# Altium schematic sheet power.SchDoc
size B
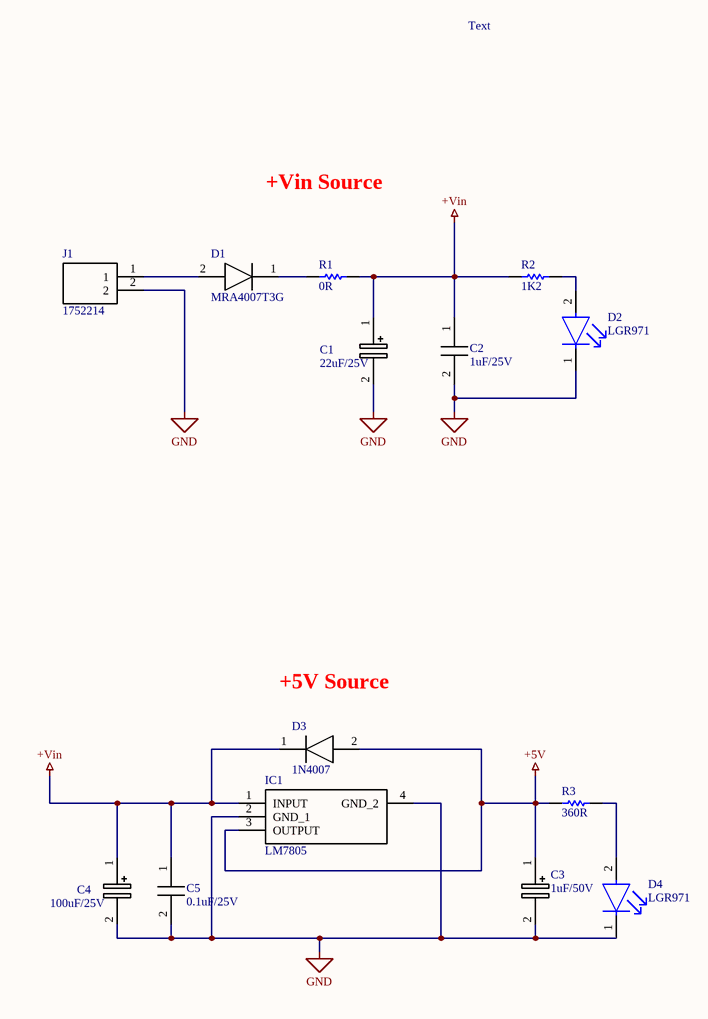
[diagram p0: power.SchDoc]

## Parts
C1  22uF/25V  [CAPAE530X610N]
C2  1uF/25V  [CAPC2012X70N]
C3  1uF/50V  [CAPAE430X550N]
C4  100uF/25V  [CAPAE660X770N]
C5  0.1uF/25V  [CAPC2012X70N]
D1  MRA4007T3G  [DIOM5226X220N]
D2  LGR971  [FP-LG_R971-MFG]
D3  1N4007  [DIOM5027X244N]
D4  LGR971  [FP-LG_R971-MFG]
IC1  LM7805  [SOT230P700X180-4N]
J1  1752214  [1752214]
R1  0R  [RESC2013X55X40NL15T20]
R2  1K2  [RESC2013X55X40NL15T20]
R3  360R  [RESC2013X55X40NL15T20]

## Nets
+5V: C3.1(+) D3.2(A) IC1.3(OUTPUT) R3.2
+Vin: C1.1(+) C2.1 C4.1(+) C5.1 D3.1(K) IC1.1(INPUT) R1.2 R2.2
GND: C1.2(-) C2.2 C3.2(-) C4.2(-) C5.2 D2.1(C) D4.1(C) IC1.2(GND_1) IC1.4(GND_2) J1.2
NetD1_1: D1.1(K) R1.1
NetD1_2: D1.2(A) J1.1
NetD2_2: D2.2(A) R2.1
NetD4_2: D4.2(A) R3.1

## Notes on the sheet
- Text
- +Vin Source
- +5V Source

## Library data of the parts
C1 = APXG250ARA220ME61G: Capacitor Polarised; Manufacturer_Name: Chemi-Con; Datasheet Link: https://datasheet.datasheetarchive.com/originals/distributors/Datasheets_SAMA/b8919aa5cd8c8f60981088f28d7e01af.pdf; Height: 6.1mm; Manufacturer_Part_Number: APXG250ARA220ME61G; Mouser Part Number: 661-APXG250A220ME61G; Mouser Price/Stock: https://www.mouser.co.uk/ProductDetail/Chemi-Con/APXG250ARA220ME61G?qs=FBI%252BX3tnPf3pLyDPuxZA9A%3D%3D; Arrow Part Number: APXG250ARA220ME61G; Arrow Price/Stock: https://www.arrow.com/en/products/apxg250ara220me61g/united-chemi-con?region=nac
C2 C5 = GRM216F51E104ZA01D: Capacitor; Manufacturer_Name: Murata Electronics; Datasheet Link: http://www.murata.com/~/media/webrenewal/support/library/catalog/products/capacitor/mlcc/c02e.pdf; Height: 0.7mm; Manufacturer_Part_Number: GRM216F51E104ZA01D; Mouser Part Number: 81-GRM40Y104Z25D; Mouser Price/Stock: https://www.mouser.co.uk/ProductDetail/Murata-Electronics/GRM216F51E104ZA01D?qs=duOfYTBEatk23Zc3Fu%2FfWg%3D%3D
C3 = 865060640001: Capacitor Polarised; Manufacturer_Name: Wurth Elektronik; Datasheet Link: http://katalog.we-online.de/pbs/datasheet/865060640001.pdf; Height: 5.5mm; Manufacturer_Part_Number: 865060640001; Mouser Part Number: 710-865060640001; Mouser Price/Stock: https://www.mouser.co.uk/ProductDetail/Wurth-Elektronik/865060640001?qs=0KOYDY2FL29jNN4jHhp9bQ%3D%3D
C4 = 865090445008: Capacitor Polarised; Manufacturer_Name: Wurth Elektronik; Datasheet Link: https://componentsearchengine.com/Datasheets/1/865090445008.pdf; Height: 7.7mm; Manufacturer_Part_Number: 865090445008; Mouser Part Number: 710-865090445008; Mouser Price/Stock: https://www.mouser.co.uk/ProductDetail/Wurth-Elektronik/865090445008?qs=0KOYDY2FL2%252B%2F1BMZ3gQUdQ%3D%3D
D1 = MRA4007T3G: Diode; Manufacturer_Name: onsemi; Datasheet Link: https://www.onsemi.com/pub/Collateral/MRA4003T3-D.PDF; Height: 2.2mm; Manufacturer_Part_Number: MRA4007T3G; Mouser Part Number: 863-MRA4007T3G; Mouser Price/Stock: https://www.mouser.co.uk/ProductDetail/onsemi/MRA4007T3G?qs=ZpPixqFcBtze9zNLkB8kog%3D%3D; Arrow Part Number: MRA4007T3G; Arrow Price/Stock: https://www.arrow.com/en/products/mra4007t3g/on-semiconductor?region=nac
D2 D4 = CMP-62016-000039-1: LED GREEN DIFFUSED 0805 SMD; Test Current: 20mA; Power Dissipation: 65mW; Number of LEDs: 1; Viewing Angle: 160°; Lens Color: White; Lens Size: 1.25mm; Forward Voltage: 2.2V; Reverse Voltage: 12V; Forward Current: 25mA; Luminous Intensity: 45mcd; Luminous Flux: 0.1lm; Dominant Wavelength: 570nm; Min Operating Temperature: -30°C; Packaging: Tape and Reel; Radiation Hardening: No; Number of Pins: 2; Case Code (Imperial): 0805; Lens Style: Diffused; Mount: Surface Mount; Package Quantity: 1; Case Code (Metric): 2012; Color: Green; Case/Package: 0805; Width: 1.25mm; Illumination Color: Green; Lens Transparency: Diffused; Max Operating Temperature: 85°C; Number of Elements: 1; Depth: 1.35mm; Height: 0.9mm; Length: 2.1mm
D3 = 1n4007-SMD: Diode; Manufacturer_Name: SYC; Datasheet Link: http://www.sycelectronica.com.ar/semiconductores/1N4007-SMD.pdf; Height: 2.438mm; Manufacturer_Part_Number: 1n4007-SMD
IC1 = LM7805MPX_NOPB: Integrated Circuit; Manufacturer_Name: Texas Instruments; Manufacturer_Part_Number: LM7805MPX/NOPB; Datasheet Link: https://www.arrow.com/en/products/lm7805mpxnopb/texas-instruments; Height: 1.8mm; Mouser Part Number: 595-LM7805MPX/NOPB; Mouser Price/Stock: https://www.mouser.co.uk/ProductDetail/Texas-Instruments/LM7805MPX-NOPB?qs=gO6GG99qvRCSwIVAoVKHPw%3D%3D; Arrow Part Number: LM7805MPX/NOPB; Arrow Price/Stock: https://www.arrow.com/en/products/lm7805mpxnopb/texas-instruments?region=nac
J1 = 1752214: Connector; Manufacturer_Name: Phoenix Contact; Datasheet Link: https://datasheet.datasheetarchive.com/originals/distributors/Datasheets_SAMA/4c4c9ca6f67cab8b5ed03ba5edf5cd72.pdf; Height: 12.65mm; Manufacturer_Part_Number: 1752214; Mouser Part Number: 651-1752214; Mouser Price/Stock: https://www.mouser.co.uk/ProductDetail/Phoenix-Contact/1752214?qs=Fz3yxlUjJZFFayST2%2F%2Ff6A%3D%3D; Arrow Part Number: 1752214; Arrow Price/Stock: https://www.arrow.com/en/products/1752214/phoenix-contact?region=nac
R1-R3 = CMP-2001-04755-1: Manufacturer: Vishay Dale; Part Number: TNPW08052K00BEEN